# EAGLE schematic ALU (EAGLE 9.6.2)
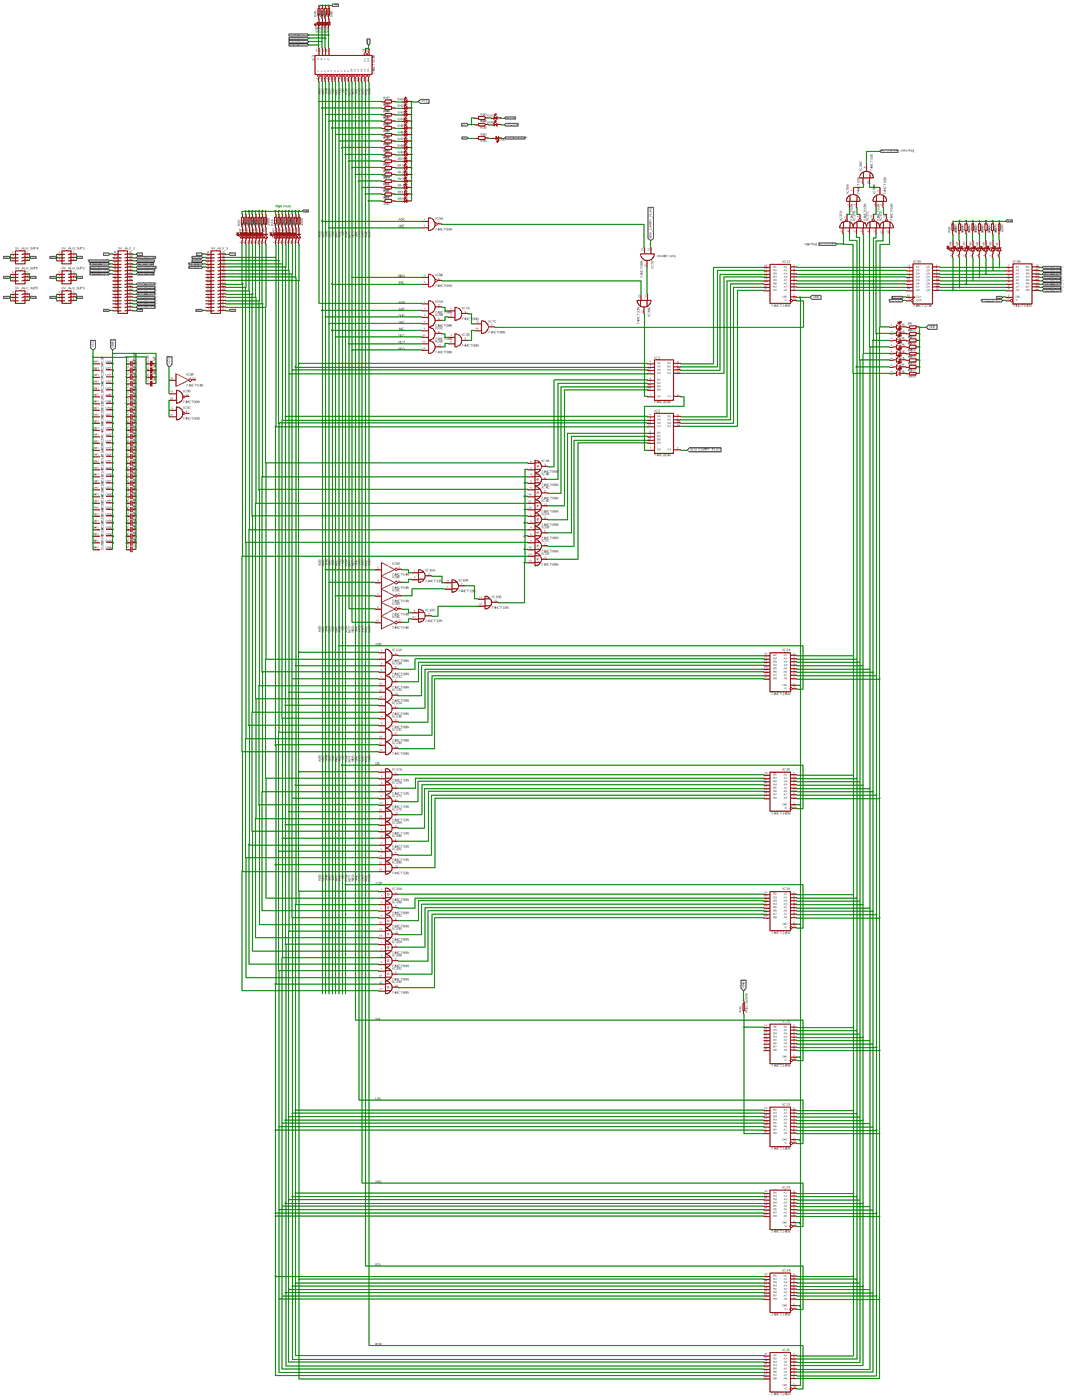
[diagram p0: schematic, sheet 1, overview]
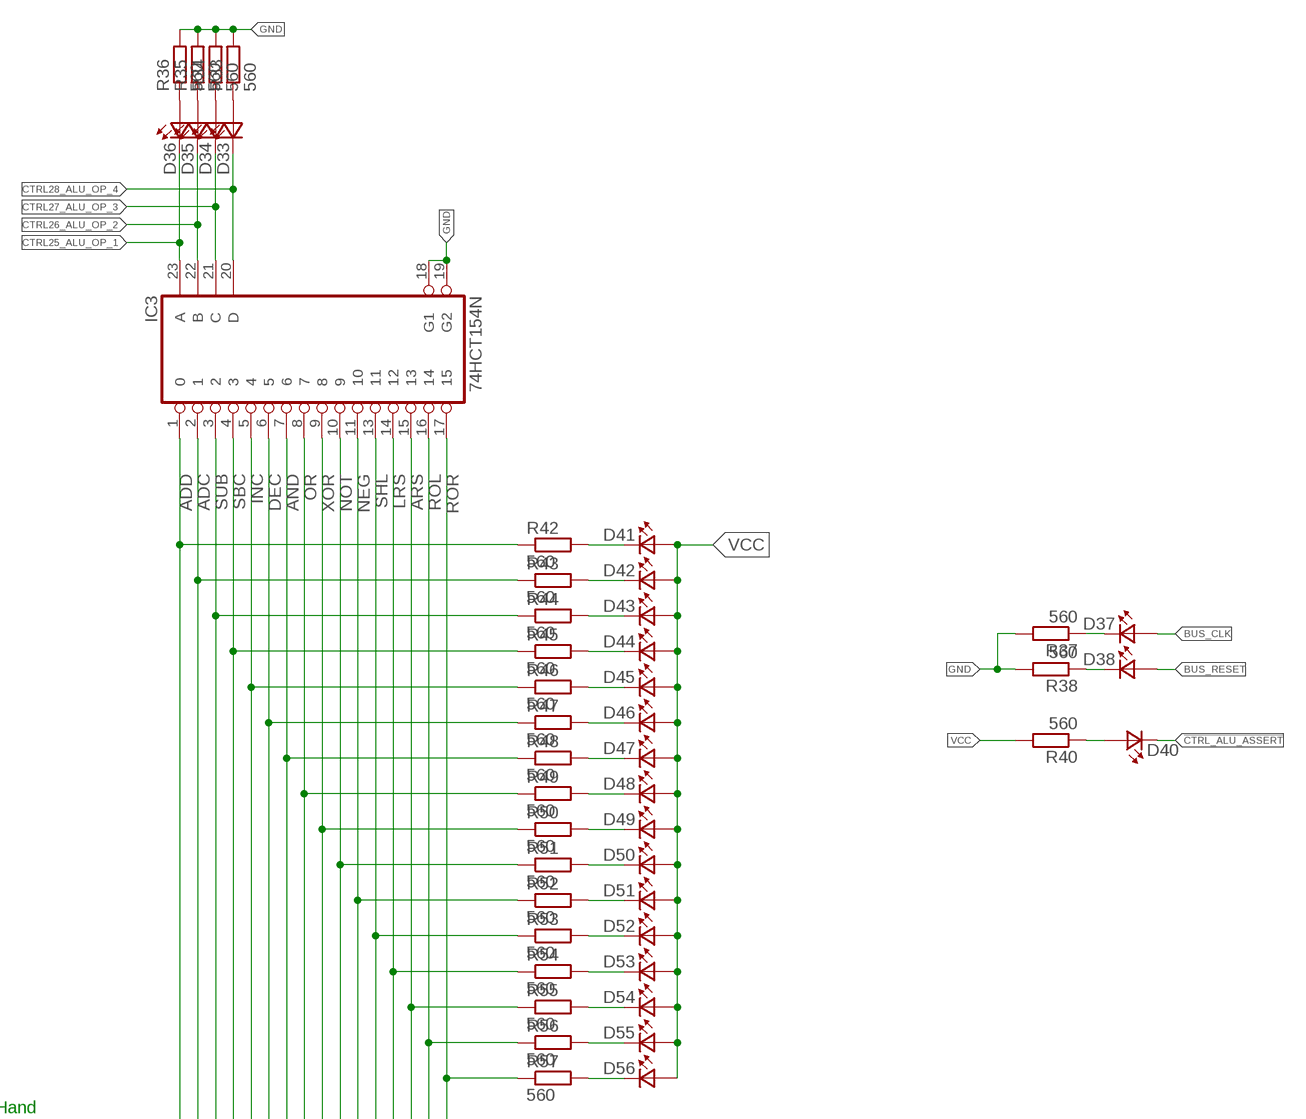
[diagram p1: schematic, sheet 1, part 1 of 8]
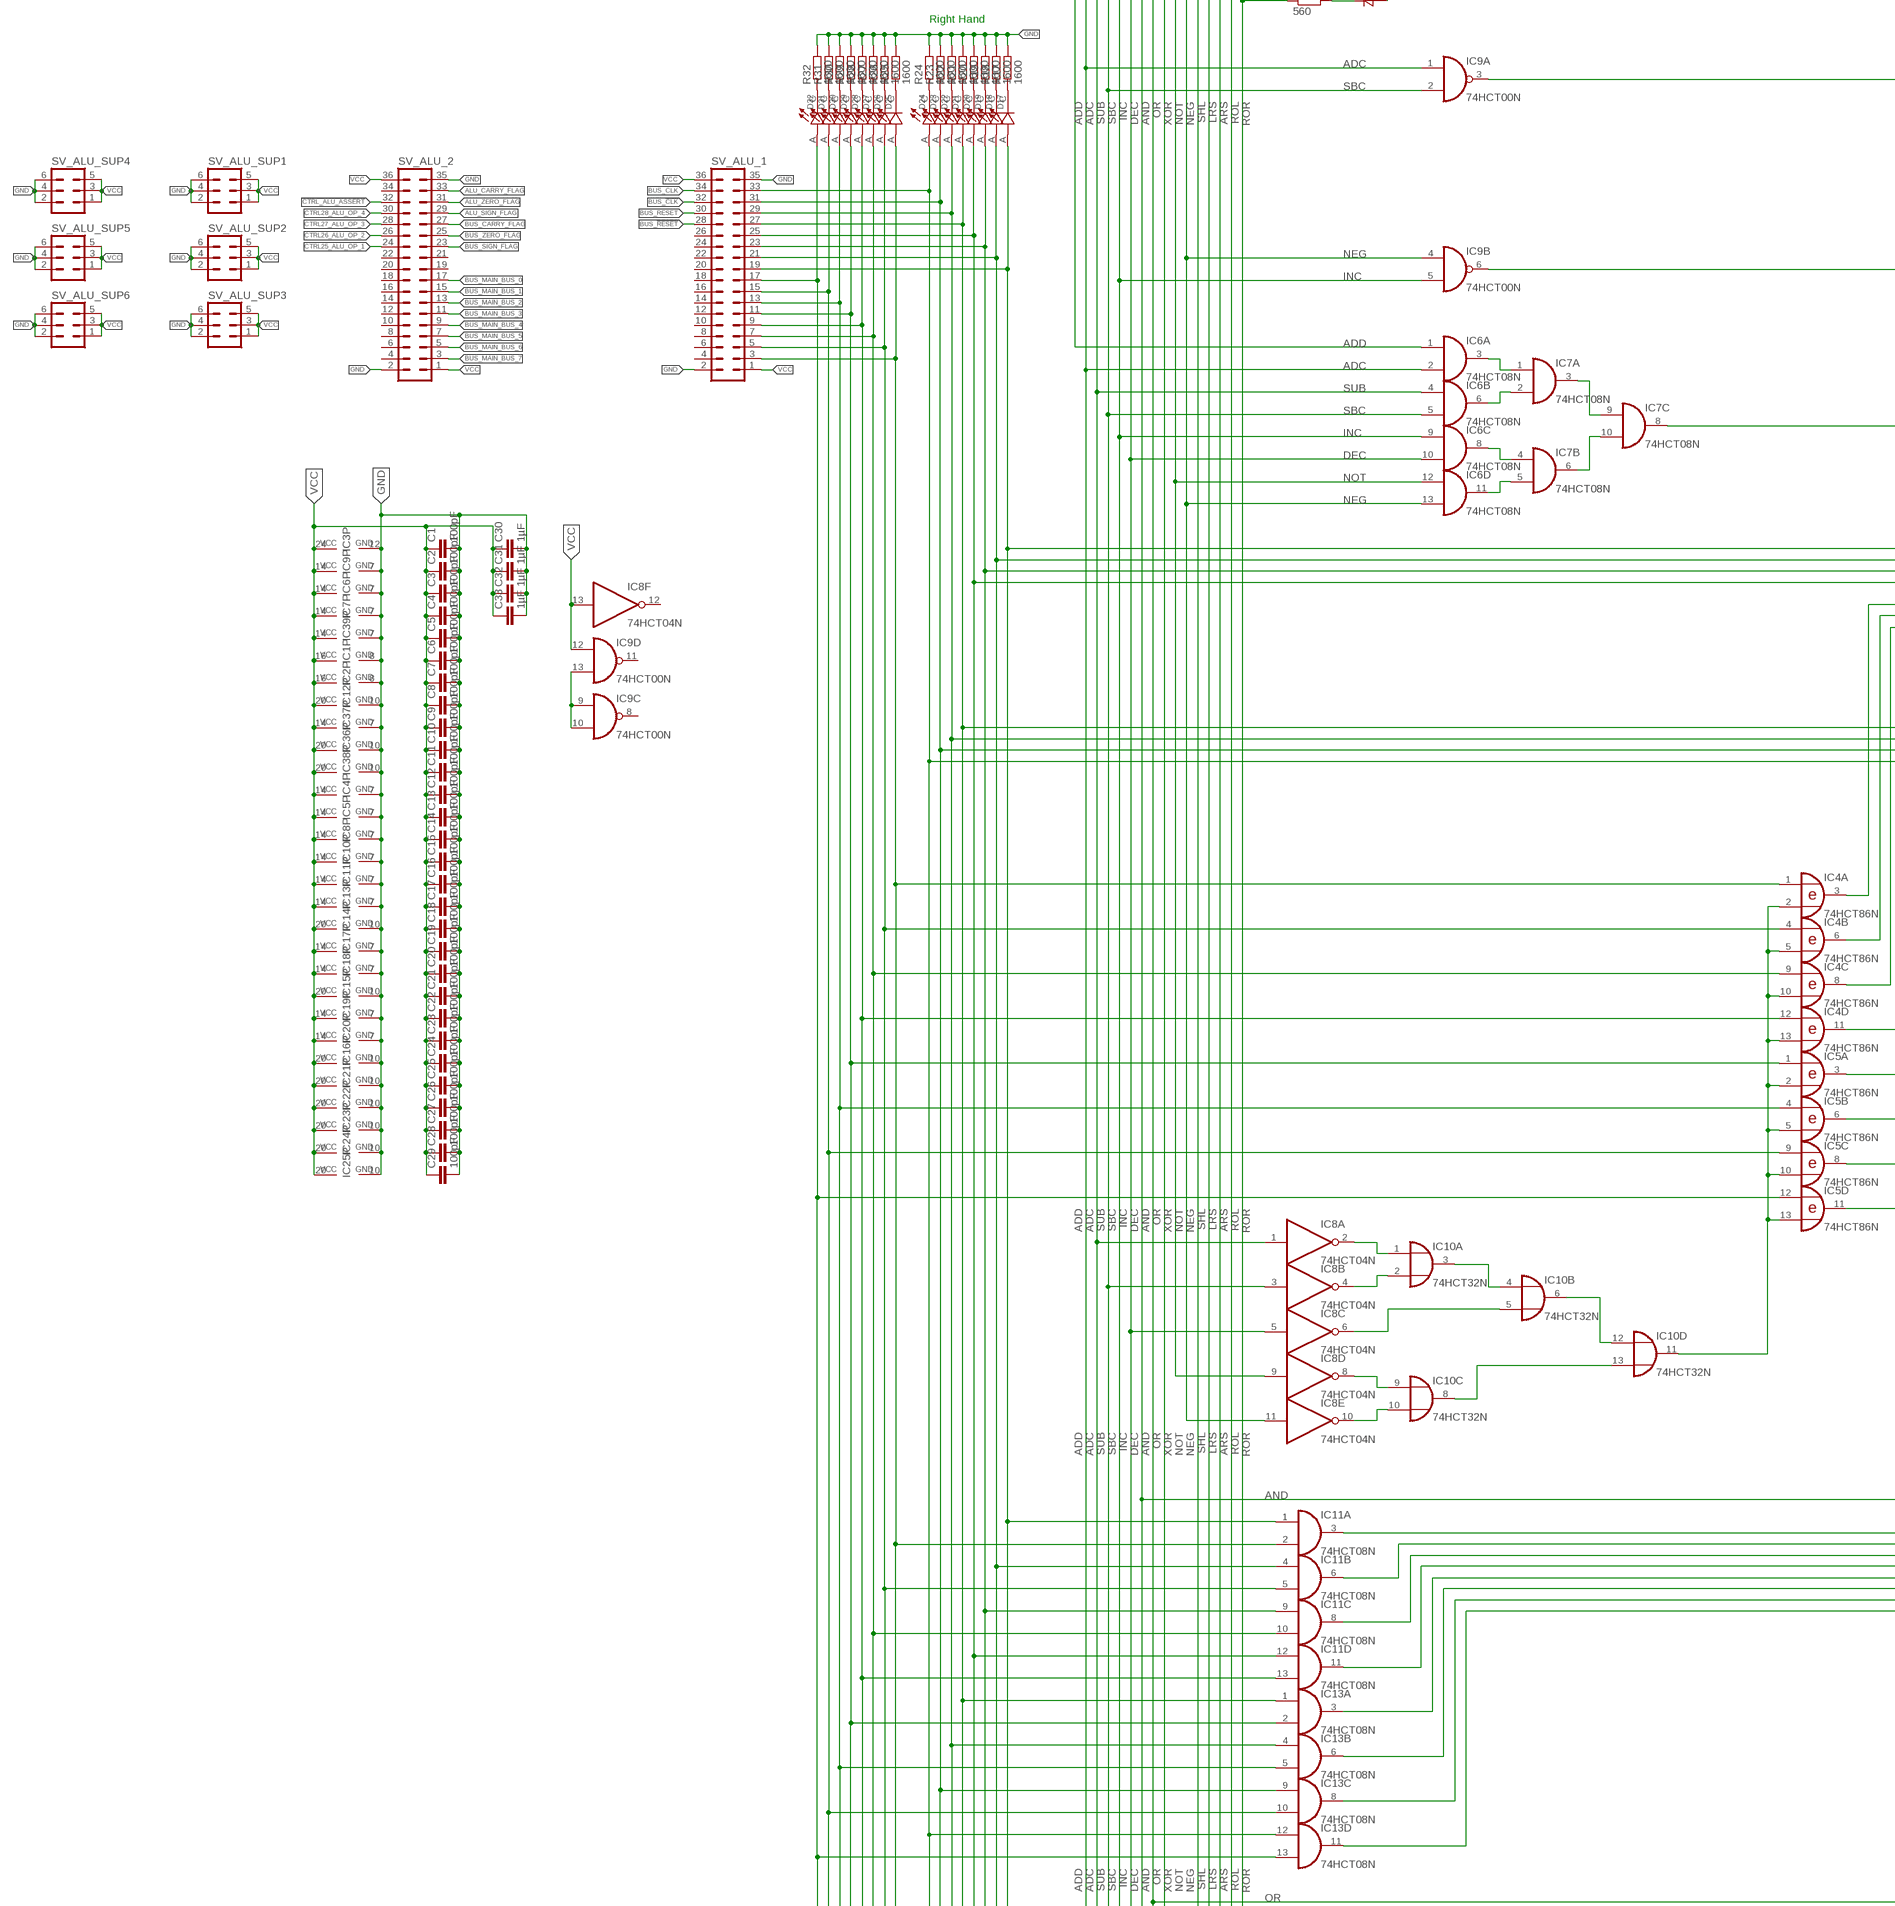
[diagram p2: schematic, sheet 1, part 2 of 8]
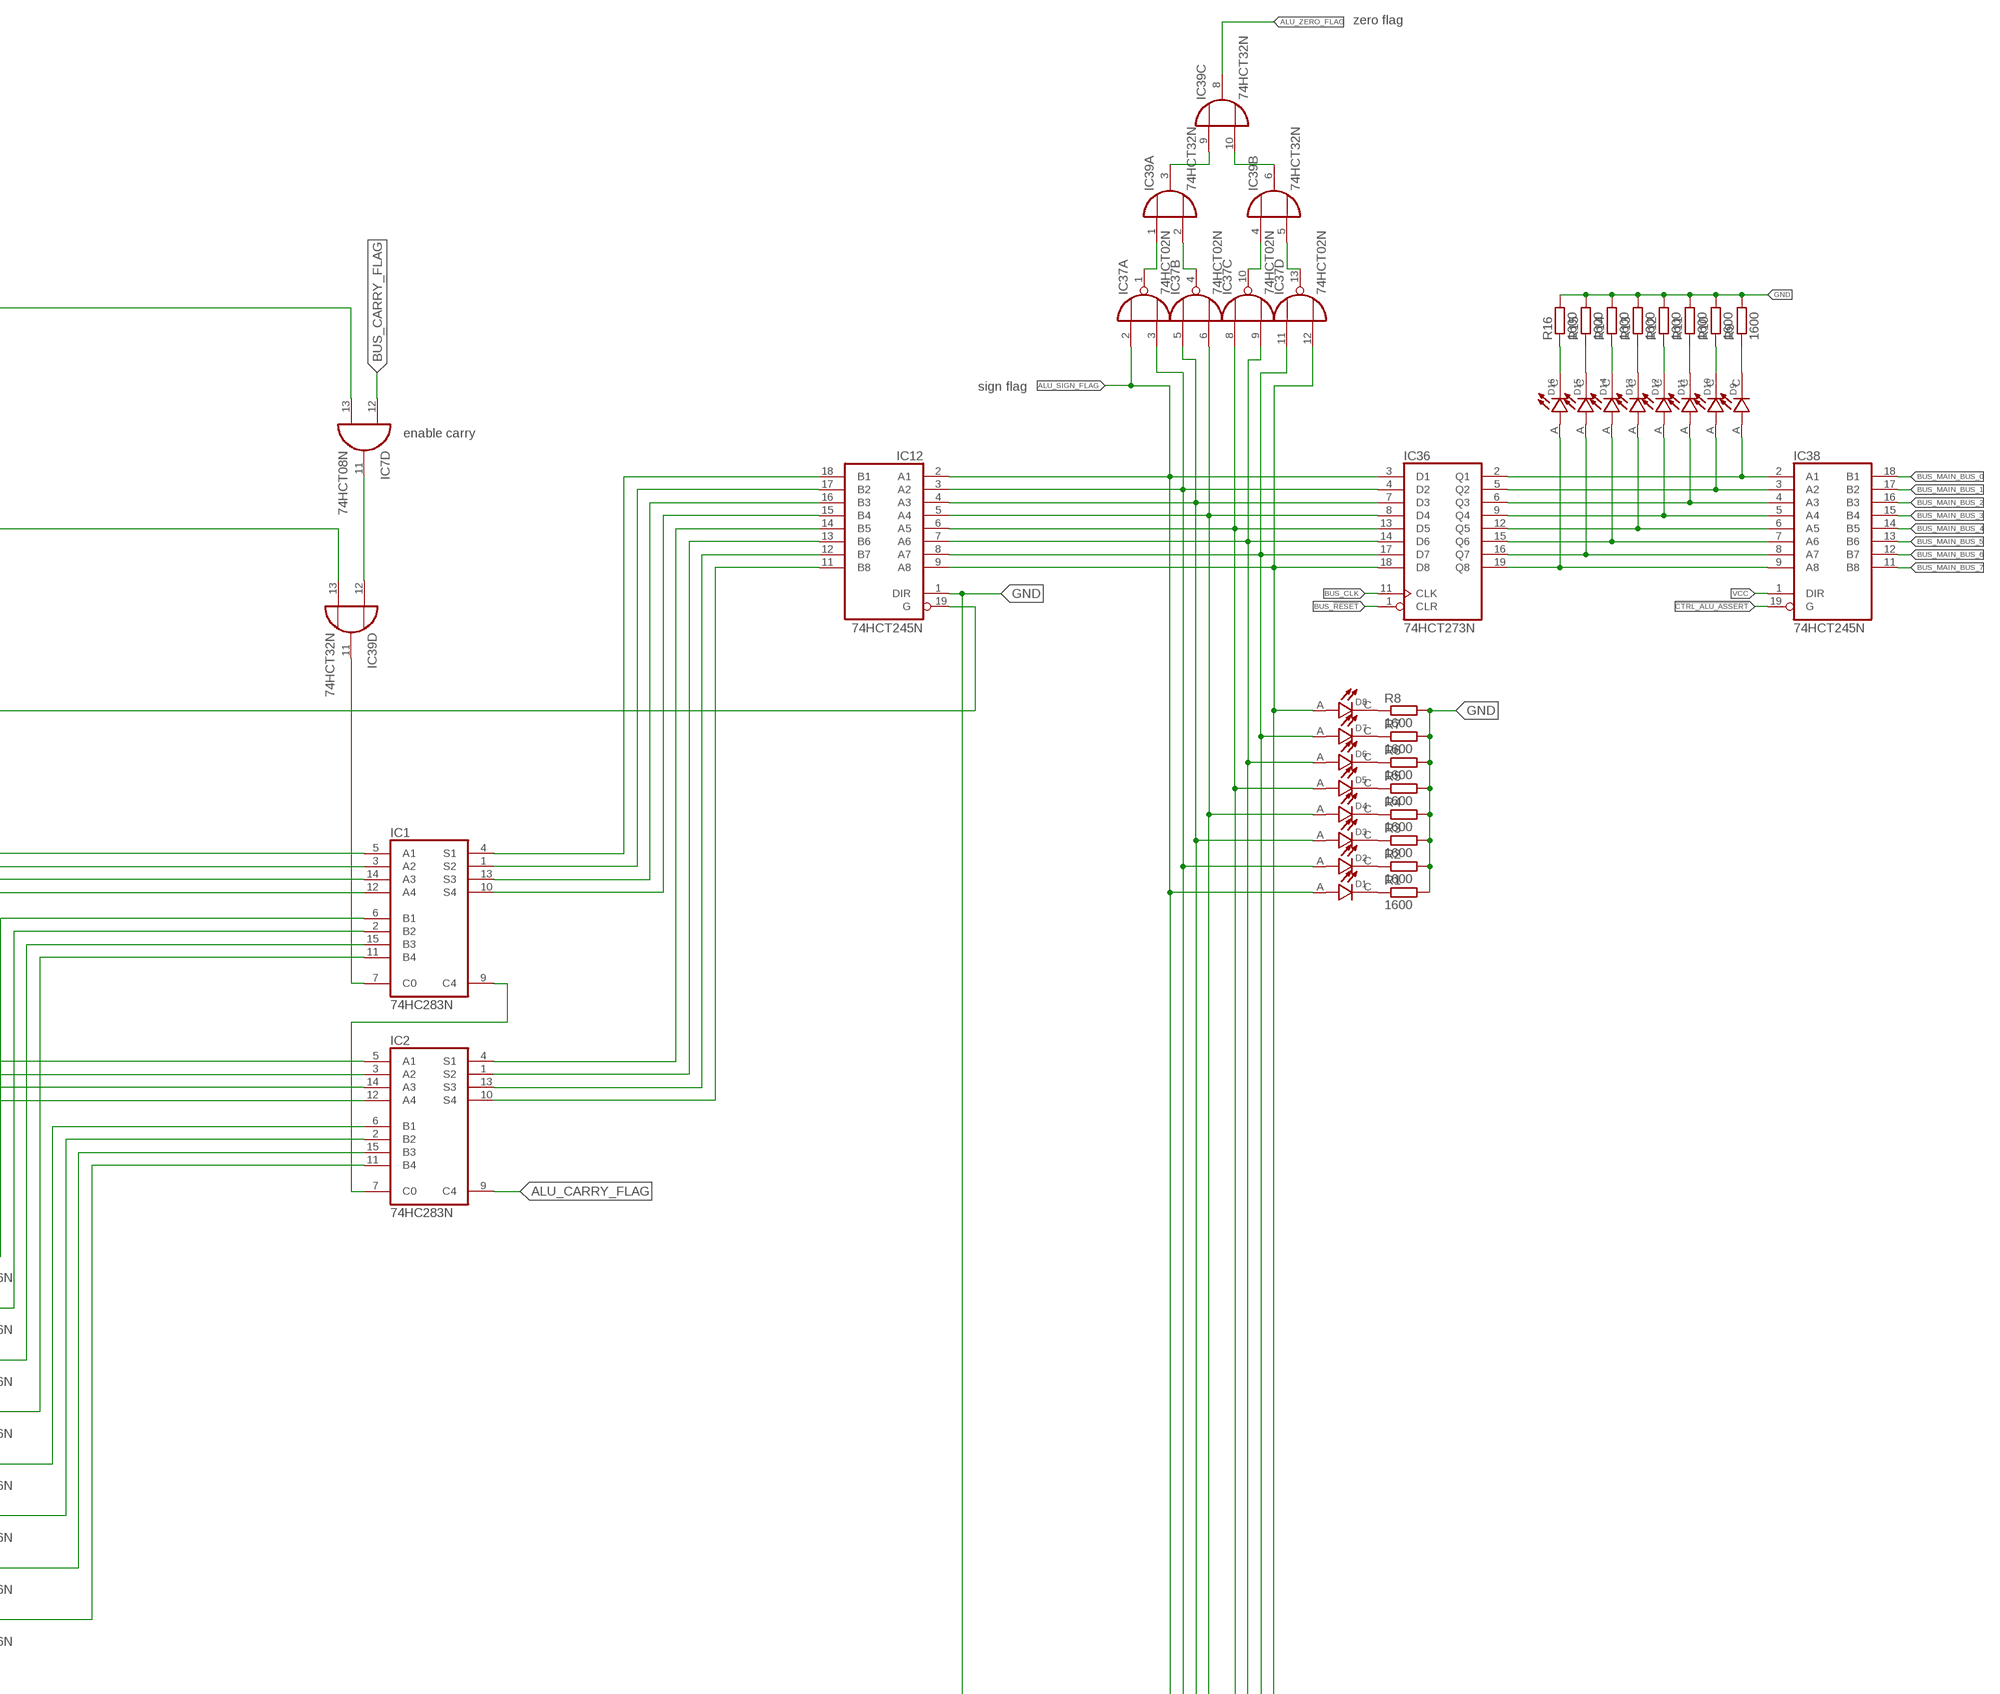
[diagram p3: schematic, sheet 1, part 3 of 8]
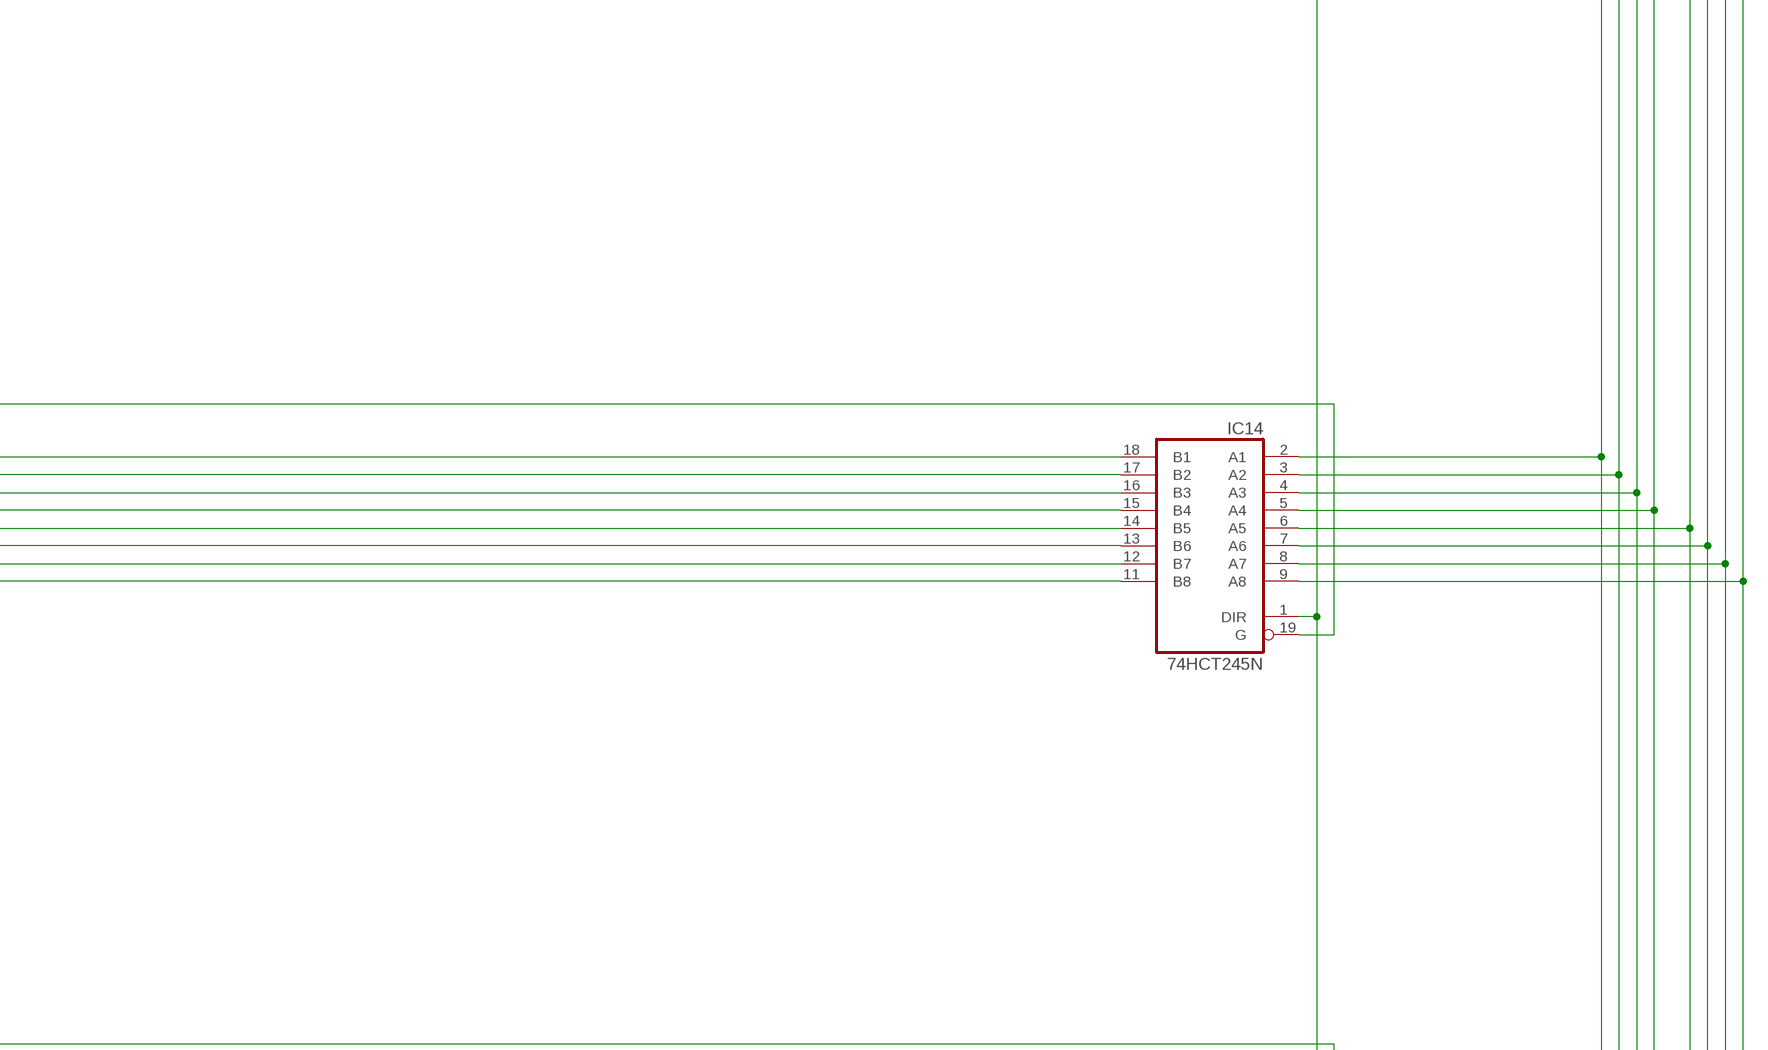
[diagram p4: schematic, sheet 1, part 4 of 8]
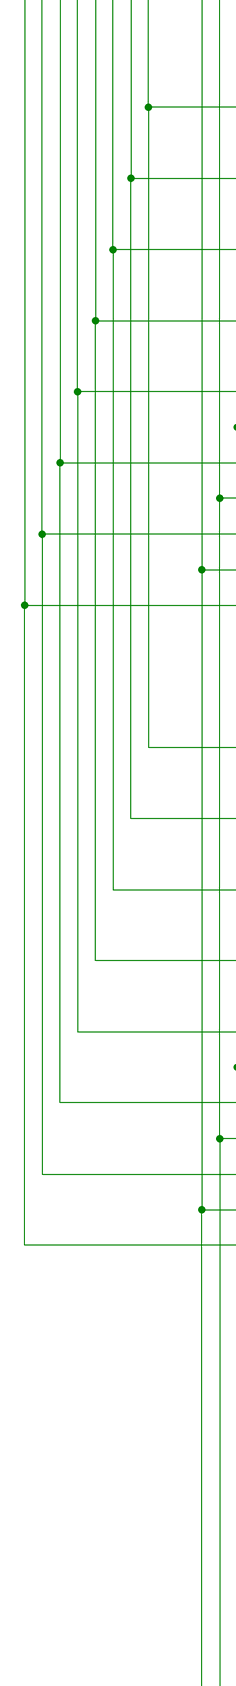
[diagram p5: schematic, sheet 1, part 5 of 8]
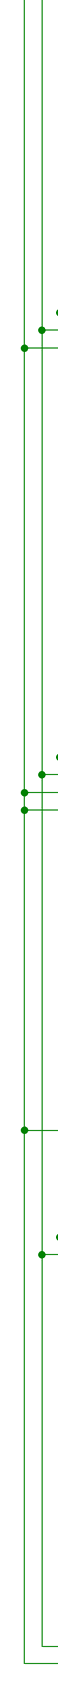
[diagram p6: schematic, sheet 1, part 6 of 8]
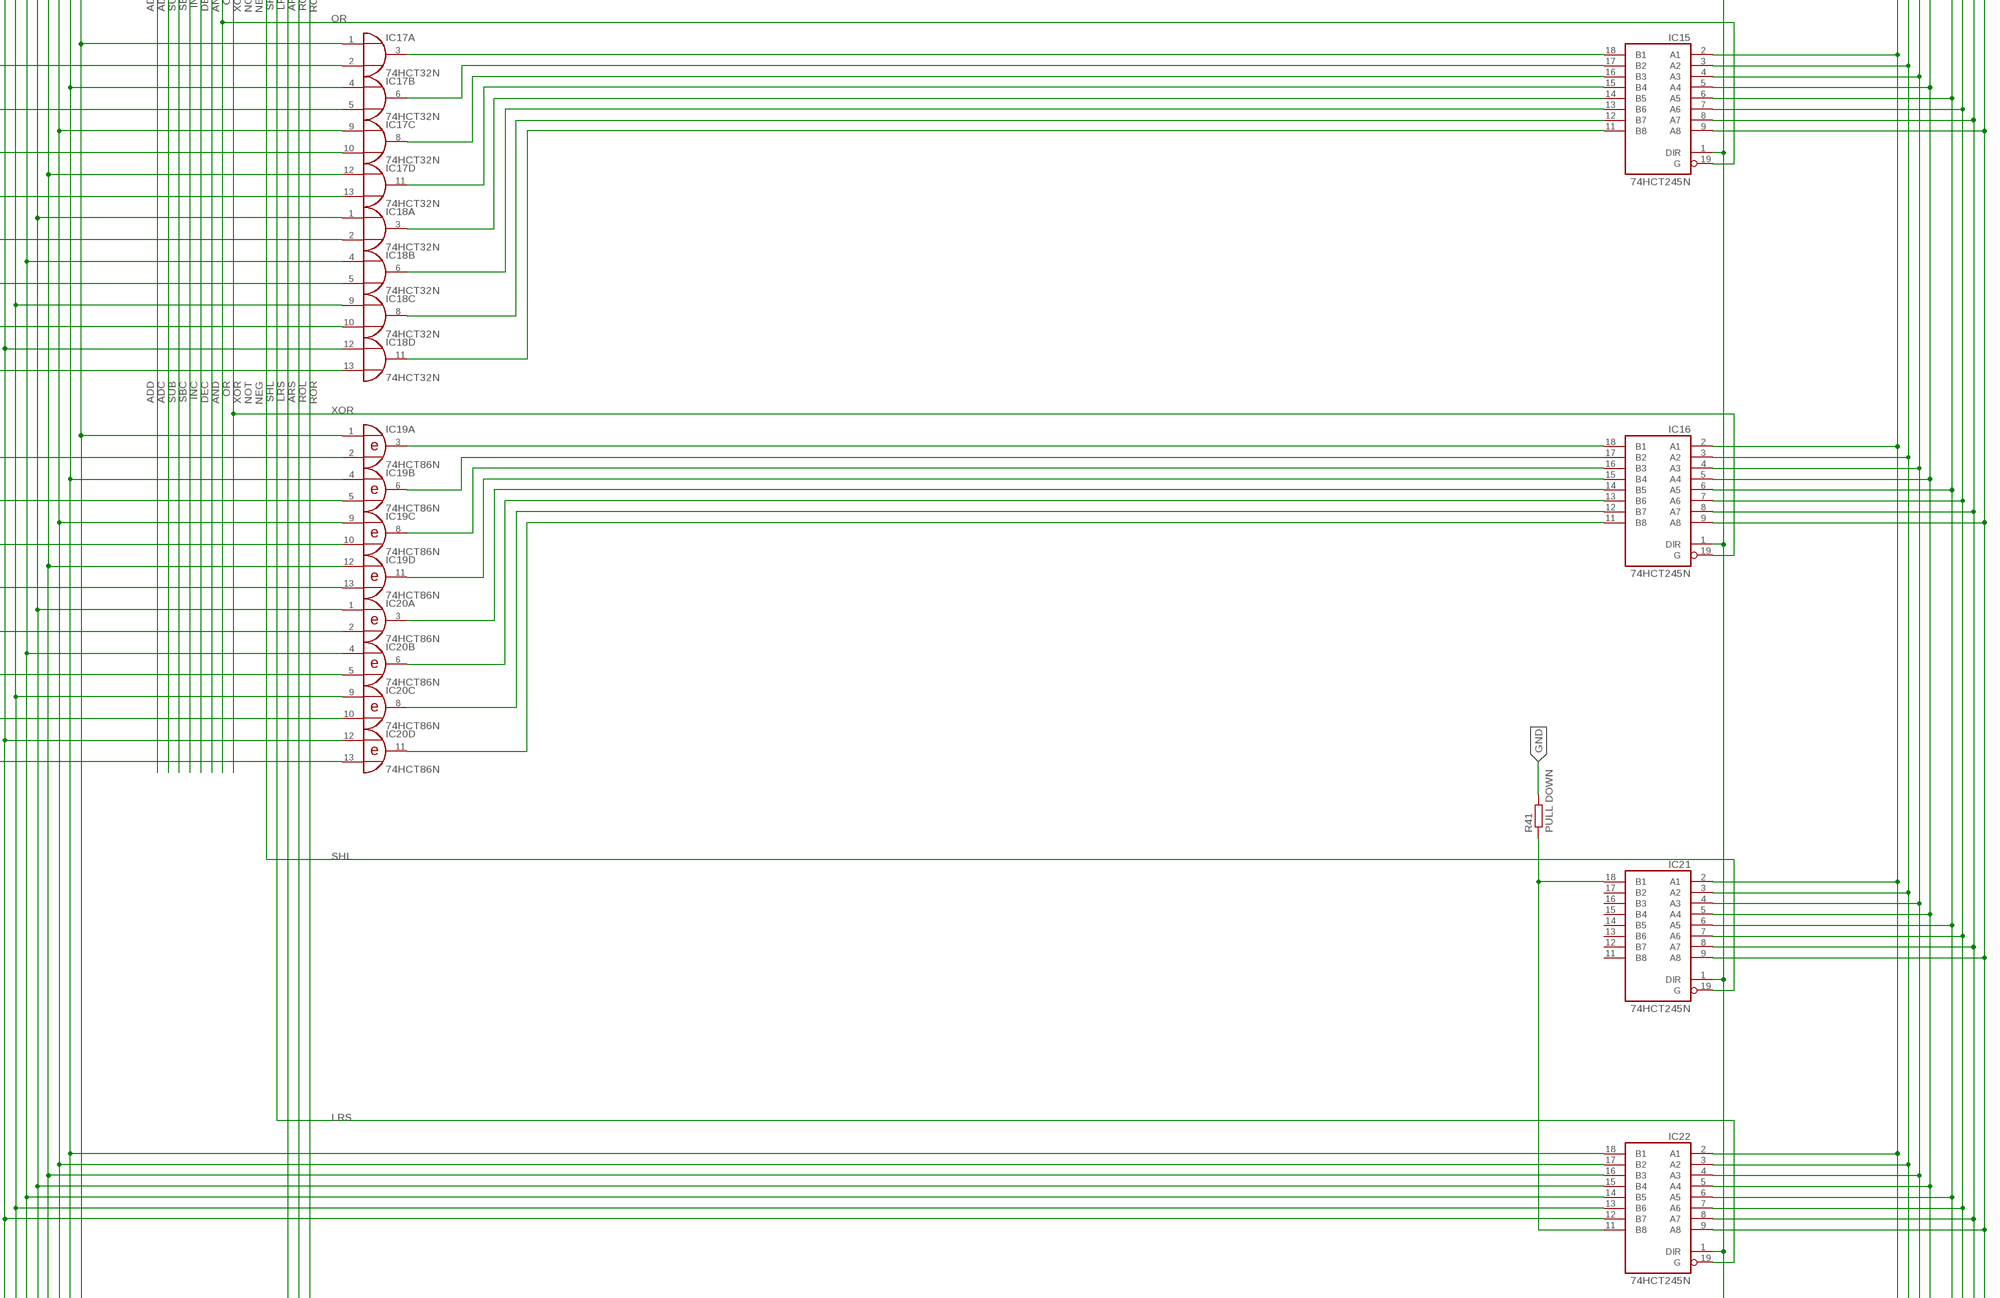
[diagram p7: schematic, sheet 1, part 7 of 8]
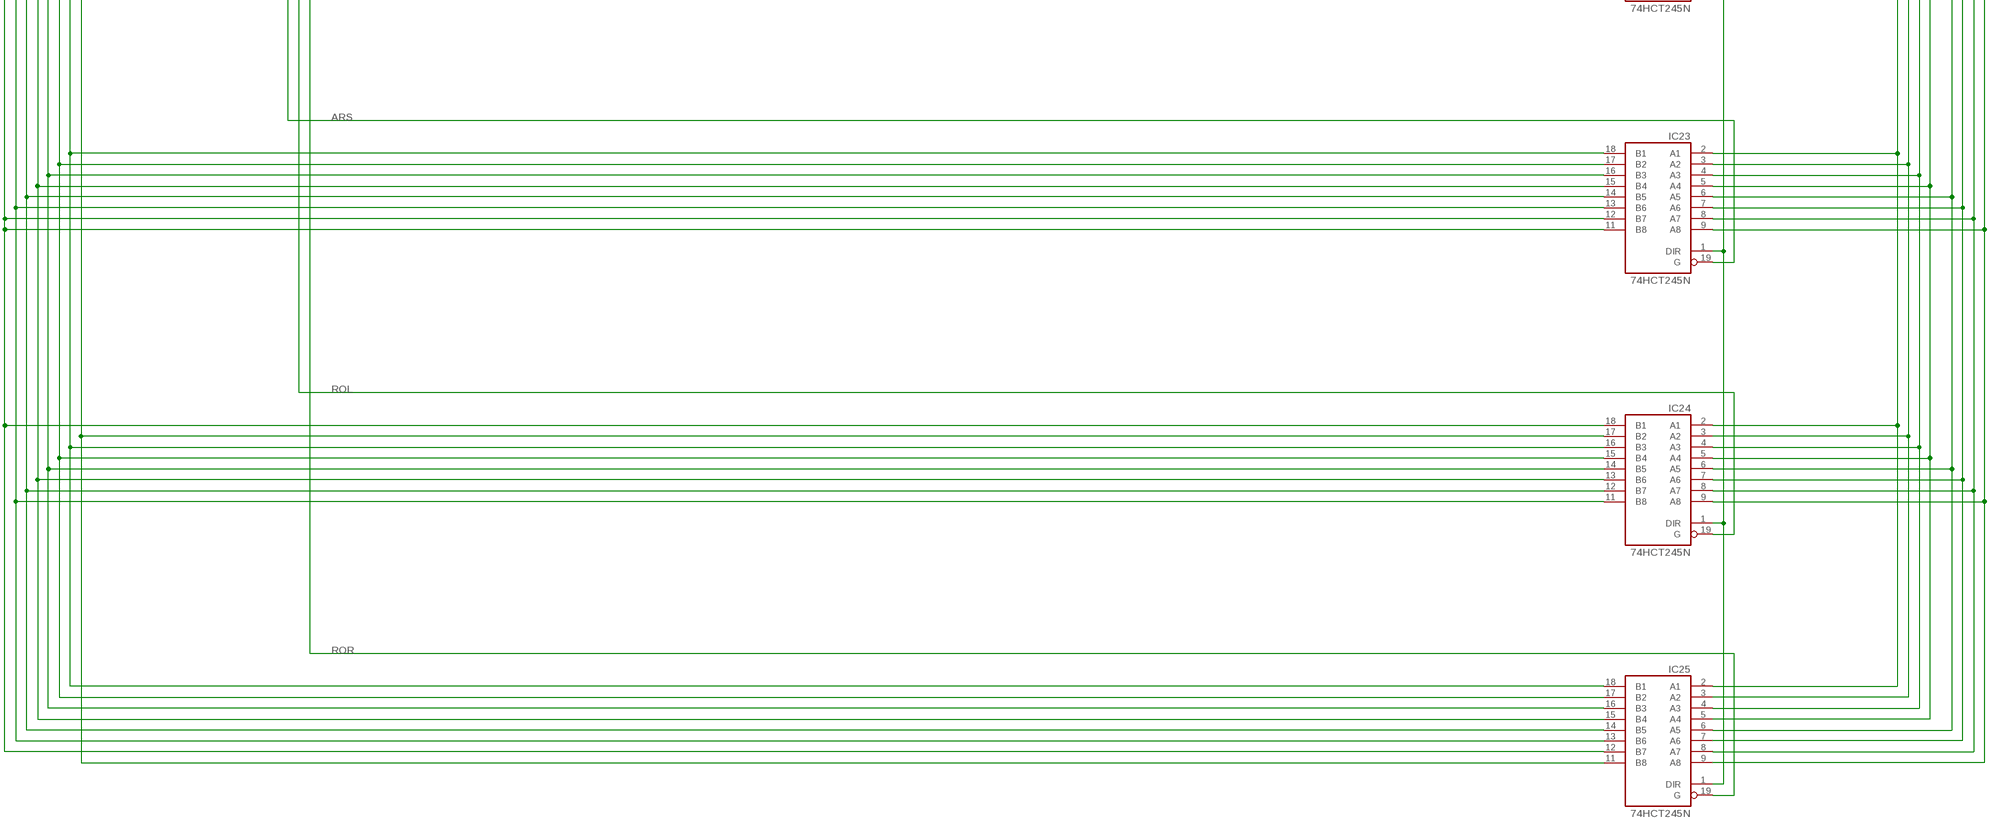
[diagram p8: schematic, sheet 1, part 8 of 8]

## Parts
C1  100pF  C-EUC0805  [C0805]
C2  100pF  C-EUC0805  [C0805]
C3  100pF  C-EUC0805  [C0805]
C4  100pF  C-EUC0805  [C0805]
C5  100pF  C-EUC0805  [C0805]
C6  100pF  C-EUC0805  [C0805]
C7  100pF  C-EUC0805  [C0805]
C8  100pF  C-EUC0805  [C0805]
C9  100pF  C-EUC0805  [C0805]
C10  100pF  C-EUC0805  [C0805]
C11  100pF  C-EUC0805  [C0805]
C12  100pF  C-EUC0805  [C0805]
C13  100pF  C-EUC0805  [C0805]
C14  100pF  C-EUC0805  [C0805]
C15  100pF  C-EUC0805  [C0805]
C16  100pF  C-EUC0805  [C0805]
C17  100pF  C-EUC0805  [C0805]
C18  100pF  C-EUC0805  [C0805]
C19  100pF  C-EUC0805  [C0805]
C20  100pF  C-EUC0805  [C0805]
C21  100pF  C-EUC0805  [C0805]
C22  100pF  C-EUC0805  [C0805]
C23  100pF  C-EUC0805  [C0805]
C24  100pF  C-EUC0805  [C0805]
C25  100pF  C-EUC0805  [C0805]
C26  100pF  C-EUC0805  [C0805]
C27  100pF  C-EUC0805  [C0805]
C28  100pF  C-EUC0805  [C0805]
C29  100pF  C-EUC0805  [C0805]
C30  1µF  C-EUC0805  [C0805]
C31  1µF  C-EUC0805  [C0805]
C32  1µF  C-EUC0805  [C0805]
C33  1µF  C-EUC0805  [C0805]
D1  LTST-C193KRKT-5A  [LEDC1608X45N]
D2  LTST-C193KRKT-5A  [LEDC1608X45N]
D3  LTST-C193KRKT-5A  [LEDC1608X45N]
D4  LTST-C193KRKT-5A  [LEDC1608X45N]
D5  LTST-C193KRKT-5A  [LEDC1608X45N]
D6  LTST-C193KRKT-5A  [LEDC1608X45N]
D7  LTST-C193KRKT-5A  [LEDC1608X45N]
D8  LTST-C193KRKT-5A  [LEDC1608X45N]
D9  LTST-C193KRKT-5A  [LEDC1608X45N]
D10  LTST-C193KRKT-5A  [LEDC1608X45N]
D11  LTST-C193KRKT-5A  [LEDC1608X45N]
D12  LTST-C193KRKT-5A  [LEDC1608X45N]
D13  LTST-C193KRKT-5A  [LEDC1608X45N]
D14  LTST-C193KRKT-5A  [LEDC1608X45N]
D15  LTST-C193KRKT-5A  [LEDC1608X45N]
D16  LTST-C193KRKT-5A  [LEDC1608X45N]
D17  LTST-C193KRKT-5A  [LEDC1608X45N]
D18  LTST-C193KRKT-5A  [LEDC1608X45N]
D19  LTST-C193KRKT-5A  [LEDC1608X45N]
D20  LTST-C193KRKT-5A  [LEDC1608X45N]
D21  LTST-C193KRKT-5A  [LEDC1608X45N]
D22  LTST-C193KRKT-5A  [LEDC1608X45N]
D23  LTST-C193KRKT-5A  [LEDC1608X45N]
D24  LTST-C193KRKT-5A  [LEDC1608X45N]
D25  LTST-C193KRKT-5A  [LEDC1608X45N]
D26  LTST-C193KRKT-5A  [LEDC1608X45N]
D27  LTST-C193KRKT-5A  [LEDC1608X45N]
D28  LTST-C193KRKT-5A  [LEDC1608X45N]
D29  LTST-C193KRKT-5A  [LEDC1608X45N]
D30  LTST-C193KRKT-5A  [LEDC1608X45N]
D31  LTST-C193KRKT-5A  [LEDC1608X45N]
D32  LTST-C193KRKT-5A  [LEDC1608X45N]
D33  LTST-C193TBKT-5A  [0603]
D34  LTST-C193TBKT-5A  [0603]
D35  LTST-C193TBKT-5A  [0603]
D36  LTST-C193TBKT-5A  [0603]
D37  LTST-C193TBKT-5A  [0603]
D38  LTST-C193TBKT-5A  [0603]
D40  LTST-C193TBKT-5A  [0603]
D41  LTST-C193TBKT-5A  [0603]
D42  LTST-C193TBKT-5A  [0603]
D43  LTST-C193TBKT-5A  [0603]
D44  LTST-C193TBKT-5A  [0603]
D45  LTST-C193TBKT-5A  [0603]
D46  LTST-C193TBKT-5A  [0603]
D47  LTST-C193TBKT-5A  [0603]
D48  LTST-C193TBKT-5A  [0603]
D49  LTST-C193TBKT-5A  [0603]
D50  LTST-C193TBKT-5A  [0603]
D51  LTST-C193TBKT-5A  [0603]
D52  LTST-C193TBKT-5A  [0603]
D53  LTST-C193TBKT-5A  [0603]
D54  LTST-C193TBKT-5A  [0603]
D55  LTST-C193TBKT-5A  [0603]
D56  LTST-C193TBKT-5A  [0603]
IC1  74HC283N  [DIL16]
IC2  74HC283N  [DIL16]
IC3  74HCT154N  [DIL24-6]
IC4  74HCT86N  [DIL14]
IC5  74HCT86N  [DIL14]
IC6  74HCT08N  [DIL14]
IC7  74HCT08N  [DIL14]
IC8  74HCT04N  [DIL14]
IC9  74HCT00N  [DIL14]
IC10  74HCT32N  [DIL14]
IC11  74HCT08N  [DIL14]
IC12  74HCT245N  [DIL20]
IC13  74HCT08N  [DIL14]
IC14  74HCT245N  [DIL20]
IC15  74HCT245N  [DIL20]
IC16  74HCT245N  [DIL20]
IC17  74HCT32N  [DIL14]
IC18  74HCT32N  [DIL14]
IC19  74HCT86N  [DIL14]
IC20  74HCT86N  [DIL14]
IC21  74HCT245N  [DIL20]
IC22  74HCT245N  [DIL20]
IC23  74HCT245N  [DIL20]
IC24  74HCT245N  [DIL20]
IC25  74HCT245N  [DIL20]
IC36  74HCT273N  [DIL20]
IC37  74HCT02N  [DIL14]
IC38  74HCT245N  [DIL20]
IC39  74HCT32N  [DIL14]
R1  1600  R-EU_R0805  [R0805]
R2  1600  R-EU_R0805  [R0805]
R3  1600  R-EU_R0805  [R0805]
R4  1600  R-EU_R0805  [R0805]
R5  1600  R-EU_R0805  [R0805]
R6  1600  R-EU_R0805  [R0805]
R7  1600  R-EU_R0805  [R0805]
R8  1600  R-EU_R0805  [R0805]
R9  1600  R-EU_R0805  [R0805]
R10  1600  R-EU_R0805  [R0805]
R11  1600  R-EU_R0805  [R0805]
R12  1600  R-EU_R0805  [R0805]
R13  1600  R-EU_R0805  [R0805]
R14  1600  R-EU_R0805  [R0805]
R15  1600  R-EU_R0805  [R0805]
R16  1600  R-EU_R0805  [R0805]
R17  1600  R-EU_R0805  [R0805]
R18  1600  R-EU_R0805  [R0805]
R19  1600  R-EU_R0805  [R0805]
R20  1600  R-EU_R0805  [R0805]
R21  1600  R-EU_R0805  [R0805]
R22  1600  R-EU_R0805  [R0805]
R23  1600  R-EU_R0805  [R0805]
R24  1600  R-EU_R0805  [R0805]
R25  1600  R-EU_R0805  [R0805]
R26  1600  R-EU_R0805  [R0805]
R27  1600  R-EU_R0805  [R0805]
R28  1600  R-EU_R0805  [R0805]
R29  1600  R-EU_R0805  [R0805]
R30  1600  R-EU_R0805  [R0805]
R31  1600  R-EU_R0805  [R0805]
R32  1600  R-EU_R0805  [R0805]
R33  560  R-EU_R0805  [R0805]
R34  560  R-EU_R0805  [R0805]
R35  560  R-EU_R0805  [R0805]
R36  560  R-EU_R0805  [R0805]
R37  560  R-EU_R0805  [R0805]
R38  560  R-EU_R0805  [R0805]
R40  560  R-EU_R0805  [R0805]
R41  PULL DOWN  R-EU_R0805  [R0805]
R42  560  R-EU_R0805  [R0805]
R43  560  R-EU_R0805  [R0805]
R44  560  R-EU_R0805  [R0805]
R45  560  R-EU_R0805  [R0805]
R46  560  R-EU_R0805  [R0805]
R47  560  R-EU_R0805  [R0805]
R48  560  R-EU_R0805  [R0805]
R49  560  R-EU_R0805  [R0805]
R50  560  R-EU_R0805  [R0805]
R51  560  R-EU_R0805  [R0805]
R52  560  R-EU_R0805  [R0805]
R53  560  R-EU_R0805  [R0805]
R54  560  R-EU_R0805  [R0805]
R55  560  R-EU_R0805  [R0805]
R56  560  R-EU_R0805  [R0805]
R57  560  R-EU_R0805  [R0805]
SV_ALU_1  MA18-2  [MA18-2]
SV_ALU_2  MA18-2  [MA18-2]
SV_ALU_SUP1  MA03-2  [MA03-2]
SV_ALU_SUP2  MA03-2  [MA03-2]
SV_ALU_SUP3  MA03-2  [MA03-2]
SV_ALU_SUP4  MA03-2  [MA03-2]
SV_ALU_SUP5  MA03-2  [MA03-2]
SV_ALU_SUP6  MA03-2  [MA03-2]

## Nets
!CTRL_ALU_ASSERT: D40.1(K2) IC38.19(G) SV_ALU_2.32
ADC: IC3.2 IC6.2(A:I1) IC9.1(A:I0) R43.1
ADD: IC3.1 IC6.1(A:I0) R42.1
ALU_CARRY_FLAG: IC2.9(C4) SV_ALU_2.33
ALU_SIGN_FLAG: D1.A IC12.2(A1) IC14.2(A1) IC15.2(A1) IC16.2(A1) IC21.2(A1) IC22.2(A1) IC23.2(A1) IC24.2(A1) IC25.2(A1) IC36.3(D1) IC37.2(A:I0) SV_ALU_2.29
ALU_ZERO_FLAG: IC39.8(C:O) SV_ALU_2.31
AND: IC3.7 IC14.19(G) R48.1
ARS: IC3.15 IC23.19(G) R55.1
BUS_!CLK: SV_ALU_1.32
BUS_!RESET: IC36.1(CLR) SV_ALU_1.28
BUS_CARRY_FLAG: IC7.12(D:I0) SV_ALU_2.27
BUS_CLK: D37.2(A2) IC36.11(CLK) SV_ALU_1.34
BUS_MAIN_BUS_0: IC38.18(B1) SV_ALU_2.17
BUS_MAIN_BUS_1: IC38.17(B2) SV_ALU_2.15
BUS_MAIN_BUS_2: IC38.16(B3) SV_ALU_2.13
BUS_MAIN_BUS_3: IC38.15(B4) SV_ALU_2.11
BUS_MAIN_BUS_4: IC38.14(B5) SV_ALU_2.9
BUS_MAIN_BUS_5: IC38.13(B6) SV_ALU_2.7
BUS_MAIN_BUS_6: IC38.12(B7) SV_ALU_2.5
BUS_MAIN_BUS_7: IC38.11(B8) SV_ALU_2.3
BUS_RESET: D38.2(A2) SV_ALU_1.30
BUS_SIGN_FLAG: SV_ALU_2.23
BUS_ZERO_FLAG: SV_ALU_2.25
CTRL25_ALU_OP_1: D36.1(K2) IC3.23(A) SV_ALU_2.24
CTRL26_ALU_OP_2: D35.1(K2) IC3.22(B) SV_ALU_2.26
CTRL27_ALU_OP_3: D34.1(K2) IC3.21(C) SV_ALU_2.28
CTRL28_ALU_OP_4: D33.1(K2) IC3.20(D) SV_ALU_2.30
DEC: IC3.6 IC6.10(C:I1) IC8.5(C:I) R47.1
GND: C1.2 C2.2 C3.2 C4.2 C5.2 C6.2 C7.2 C8.2 C9.2 C10.2 C11.2 C12.2 C13.2 C14.2 C15.2 C16.2 C17.2 C18.2 C19.2 C20.2 C21.2 C22.2 C23.2 C24.2 C25.2 C26.2 C27.2 C28.2 C29.2 C30.2 C31.2 C32.2 C33.2 IC1.8(GND) IC2.8(GND) IC3.12(GND) IC3.18(G1) IC3.19(G2) IC4.7(P:GND) IC5.7(P:GND) IC6.7(P:GND) IC7.7(P:GND) IC8.7(P:GND) IC9.7(P:GND) IC10.7(P:GND) IC11.7(P:GND) IC12.1(DIR) IC12.10(GND) IC13.7(P:GND) IC14.1(DIR) IC14.10(GND) IC15.1(DIR) IC15.10(GND) IC16.1(DIR) IC16.10(GND) IC17.7(P:GND) IC18.7(P:GND) IC19.7(P:GND) IC20.7(P:GND) IC21.1(DIR) IC21.10(GND) IC22.1(DIR) IC22.10(GND) IC23.1(DIR) IC23.10(GND) IC24.1(DIR) IC24.10(GND) IC25.1(DIR) IC25.10(GND) IC36.10(GND) IC37.7(P:GND) IC38.10(GND) IC39.7(P:GND) R1.2 R2.2 R3.2 R4.2 R5.2 R6.2 R7.2 R8.2 R9.2 R10.2 R11.2 R12.2 R13.2 R14.2 R15.2 R16.2 R17.2 R18.2 R19.2 R20.2 R21.2 R22.2 R23.2 R24.2 R25.2 R26.2 R27.2 R28.2 R29.2 R30.2 R31.2 R32.2 R33.2 R34.2 R35.2 R36.2 R37.2 R38.2 R41.2 SV_ALU_1.2 SV_ALU_1.35 SV_ALU_2.2 SV_ALU_2.35 SV_ALU_SUP1.2 SV_ALU_SUP1.4 SV_ALU_SUP1.6 SV_ALU_SUP2.2 SV_ALU_SUP2.4 SV_ALU_SUP2.6 SV_ALU_SUP3.2 SV_ALU_SUP3.4 SV_ALU_SUP3.6 SV_ALU_SUP4.2 SV_ALU_SUP4.4 SV_ALU_SUP4.6 SV_ALU_SUP5.2 SV_ALU_SUP5.4 SV_ALU_SUP5.6 SV_ALU_SUP6.2 SV_ALU_SUP6.4 SV_ALU_SUP6.6
INC: IC3.5 IC6.9(C:I0) IC9.5(B:I1) R46.1
LRS: IC3.14 IC22.19(G) R54.1
N$1: IC4.2(A:I1) IC4.5(B:I1) IC4.10(C:I1) IC4.13(D:I1) IC5.2(A:I1) IC5.5(B:I1) IC5.10(C:I1) IC5.13(D:I1) IC10.11(D:O)
N$2: IC1.6(B1) IC4.3(A:O)
N$3: D33.2(A2) R33.1
N$4: IC1.2(B2) IC4.6(B:O)
N$5: D27.A IC4.9(C:I0) IC11.10(C:I1) IC17.10(C:I1) IC19.10(C:I1) SV_ALU_1.7
N$6: IC1.15(B3) IC4.8(C:O)
N$7: IC1.11(B4) IC4.11(D:O)
N$8: IC2.6(B1) IC5.3(A:O)
N$9: IC2.2(B2) IC5.6(B:O)
N$10: IC2.15(B3) IC5.8(C:O)
N$11: IC2.11(B4) IC5.11(D:O)
N$12: IC1.9(C4) IC2.7(C0)
N$13: IC1.7(C0) IC39.11(D:O)
N$14: IC1.4(S1) IC12.18(B1)
N$15: IC1.1(S2) IC12.17(B2)
N$16: D16.C R16.1
N$17: IC1.13(S3) IC12.16(B3)
N$18: IC1.10(S4) IC12.15(B4)
N$19: IC2.4(S1) IC12.14(B5)
N$20: IC37.1(A:O) IC39.1(A:I0)
N$21: IC37.4(B:O) IC39.2(A:I1)
N$22: IC37.10(C:O) IC39.4(B:I0)
N$23: IC37.13(D:O) IC39.5(B:I1)
N$24: D15.C R15.1
N$25: IC39.6(B:O) IC39.10(C:I1)
N$26: IC39.3(A:O) IC39.9(C:I0)
N$27: D34.2(A2) R34.1
N$28: D35.2(A2) R35.1
N$29: D36.2(A2) R36.1
N$30: D40.2(A2) R40.1
N$32: IC2.1(S2) IC12.13(B6)
N$33: IC2.13(S3) IC12.12(B7)
N$34: IC2.10(S4) IC12.11(B8)
N$35: IC6.3(A:O) IC7.1(A:I0)
N$36: IC6.6(B:O) IC7.2(A:I1)
N$37: IC6.8(C:O) IC7.4(B:I0)
N$38: IC6.11(D:O) IC7.5(B:I1)
N$39: IC7.3(A:O) IC7.9(C:I0)
N$40: IC7.6(B:O) IC7.10(C:I1)
N$41: IC7.8(C:O) IC12.19(G)
N$42: IC7.11(D:O) IC39.12(D:I0)
N$43: IC9.6(B:O) IC39.13(D:I1)
N$44: IC7.13(D:I1) IC9.3(A:O)
N$45: IC8.2(A:O) IC10.1(A:I0)
N$46: IC8.4(B:O) IC10.2(A:I1)
N$47: IC10.3(A:O) IC10.4(B:I0)
N$48: IC8.6(C:O) IC10.5(B:I1)
N$49: IC8.8(D:O) IC10.9(C:I0)
N$50: IC8.10(E:O) IC10.10(C:I1)
N$51: D1.C R1.1
N$52: IC10.8(C:O) IC10.13(D:I1)
N$53: IC10.6(B:O) IC10.12(D:I0)
N$54: D41.1(K2) R42.2
N$55: IC11.6(B:O) IC14.17(B2)
N$56: IC11.8(C:O) IC14.16(B3)
N$57: IC11.11(D:O) IC14.15(B4)
N$58: IC13.3(A:O) IC14.14(B5)
N$59: IC13.6(B:O) IC14.13(B6)
N$60: IC13.8(C:O) IC14.12(B7)
N$61: IC13.11(D:O) IC14.11(B8)
N$62: IC16.18(B1) IC19.3(A:O)
N$63: D14.C R14.1
N$64: D21.A IC2.5(A1) IC13.1(A:I0) IC18.1(A:I0) IC20.1(A:I0) IC22.15(B4) IC23.15(B4) IC24.13(B6) IC25.15(B4) SV_ALU_1.27
N$65: D22.A IC2.3(A2) IC13.4(B:I0) IC18.4(B:I0) IC20.4(B:I0) IC22.14(B5) IC23.14(B5) IC24.12(B7) IC25.14(B5) SV_ALU_1.29
N$66: D23.A IC2.14(A3) IC13.9(C:I0) IC18.9(C:I0) IC20.9(C:I0) IC22.13(B6) IC23.13(B6) IC24.11(B8) IC25.13(B6) SV_ALU_1.31
N$67: D24.A IC2.12(A4) IC13.12(D:I0) IC18.12(D:I0) IC20.12(D:I0) IC22.12(B7) IC23.11(B8) IC23.12(B7) IC24.18(B1) IC25.12(B7) SV_ALU_1.33
N$68: D2.C R2.1
N$69: D32.A IC5.12(D:I0) IC13.13(D:I1) IC18.13(D:I1) IC20.13(D:I1) SV_ALU_1.17
N$70: IC15.17(B2) IC17.6(B:O)
N$71: D13.C R13.1
N$72: D12.C R12.1
N$73: IC15.16(B3) IC17.8(C:O)
N$74: IC15.15(B4) IC17.11(D:O)
N$75: IC15.14(B5) IC18.3(A:O)
N$76: IC15.13(B6) IC18.6(B:O)
N$77: D38.1(K2) R38.1
N$78: D37.1(K2) R37.1
N$79: D17.A IC1.5(A1) IC11.1(A:I0) IC17.1(A:I0) IC19.1(A:I0) IC24.17(B2) IC25.11(B8) SV_ALU_1.19
N$80: D18.A IC1.3(A2) IC11.4(B:I0) IC17.4(B:I0) IC19.4(B:I0) IC22.18(B1) IC23.18(B1) IC24.16(B3) IC25.18(B1) SV_ALU_1.21
N$81: D19.A IC1.14(A3) IC11.9(C:I0) IC17.9(C:I0) IC19.9(C:I0) IC22.17(B2) IC23.17(B2) IC24.15(B4) IC25.17(B2) SV_ALU_1.23
N$82: D20.A IC1.12(A4) IC11.12(D:I0) IC17.12(D:I0) IC19.12(D:I0) IC22.16(B3) IC23.16(B3) IC24.14(B5) IC25.16(B3) SV_ALU_1.25
N$83: IC15.12(B7) IC18.8(C:O)
N$84: IC15.11(B8) IC18.11(D:O)
N$85: IC15.18(B1) IC17.3(A:O)
N$86: IC16.17(B2) IC19.6(B:O)
N$87: IC16.16(B3) IC19.8(C:O)
N$88: IC16.15(B4) IC19.11(D:O)
N$89: IC16.14(B5) IC20.3(A:O)
N$90: IC16.13(B6) IC20.6(B:O)
N$91: IC16.12(B7) IC20.8(C:O)
N$92: IC16.11(B8) IC20.11(D:O)
N$93: IC21.18(B1) IC22.11(B8) R41.1
N$94: IC9.9(C:I0) IC9.10(C:I1) IC9.13(D:I1)
N$95: IC11.3(A:O) IC14.18(B1)
N$96: D42.1(K2) R43.2
N$97: D43.1(K2) R44.2
N$98: D44.1(K2) R45.2
N$99: D45.1(K2) R46.2
N$100: D46.1(K2) R47.2
N$101: D47.1(K2) R48.2
N$102: D48.1(K2) R49.2
N$103: D49.1(K2) R50.2
N$104: D50.1(K2) R51.2
N$105: D51.1(K2) R52.2
N$106: D52.1(K2) R53.2
N$107: D53.1(K2) R54.2
N$108: D54.1(K2) R55.2
N$109: D55.1(K2) R56.2
N$110: D56.1(K2) R57.2
N$119: D25.A IC4.1(A:I0) IC11.2(A:I1) IC17.2(A:I1) IC19.2(A:I1) SV_ALU_1.3
N$120: D26.A IC4.4(B:I0) IC11.5(B:I1) IC17.5(B:I1) IC19.5(B:I1) SV_ALU_1.5
N$122: D28.A IC4.12(D:I0) IC11.13(D:I1) IC17.13(D:I1) IC19.13(D:I1) SV_ALU_1.9
N$123: D29.A IC5.1(A:I0) IC13.2(A:I1) IC18.2(A:I1) IC20.2(A:I1) SV_ALU_1.11
N$124: D30.A IC5.4(B:I0) IC13.5(B:I1) IC18.5(B:I1) IC20.5(B:I1) SV_ALU_1.13
N$125: D31.A IC5.9(C:I0) IC13.10(C:I1) IC18.10(C:I1) IC20.10(C:I1) SV_ALU_1.15
N$129: D2.A IC12.3(A2) IC14.3(A2) IC15.3(A2) IC16.3(A2) IC21.3(A2) IC22.3(A2) IC23.3(A2) IC24.3(A2) IC25.3(A2) IC36.4(D2) IC37.3(A:I1)
N$130: D3.A IC12.4(A3) IC14.4(A3) IC15.4(A3) IC16.4(A3) IC21.4(A3) IC22.4(A3) IC23.4(A3) IC24.4(A3) IC25.4(A3) IC36.7(D3) IC37.5(B:I0)
N$131: D4.A IC12.5(A4) IC14.5(A4) IC15.5(A4) IC16.5(A4) IC21.5(A4) IC22.5(A4) IC23.5(A4) IC24.5(A4) IC25.5(A4) IC36.8(D4) IC37.6(B:I1)
N$132: D11.C R11.1
N$133: D10.C R10.1
N$134: D9.C R9.1
N$136: D3.C R3.1
N$137: D4.C R4.1
N$138: D5.C R5.1
N$139: D6.C R6.1
N$140: D7.C R7.1
N$141: D8.C R8.1
N$142: D17.C R17.1
N$143: D18.C R18.1
N$144: D19.C R19.1
N$145: D20.C R20.1
N$146: D21.C R21.1
N$147: D22.C R22.1
N$148: D23.C R23.1
N$149: D24.C R24.1
N$150: D25.C R25.1
N$151: D26.C R26.1
N$152: D27.C R27.1
N$153: D28.C R28.1
N$154: D29.C R29.1
N$155: D30.C R30.1
N$156: D16.A IC36.19(Q8) IC38.9(A8)
N$157: D15.A IC36.16(Q7) IC38.8(A7)
N$158: D14.A IC36.15(Q6) IC38.7(A6)
N$159: D13.A IC36.12(Q5) IC38.6(A5)
N$160: D12.A IC36.9(Q4) IC38.5(A4)
N$161: D11.A IC36.6(Q3) IC38.4(A3)
N$162: D10.A IC36.5(Q2) IC38.3(A2)
N$163: D9.A IC36.2(Q1) IC38.2(A1)
N$164: D31.C R31.1
N$165: D32.C R32.1
N$166: D5.A IC12.6(A5) IC14.6(A5) IC15.6(A5) IC16.6(A5) IC21.6(A5) IC22.6(A5) IC23.6(A5) IC24.6(A5) IC25.6(A5) IC36.13(D5) IC37.8(C:I0)
N$167: D7.A IC12.8(A7) IC14.8(A7) IC15.8(A7) IC16.8(A7) IC21.8(A7) IC22.8(A7) IC23.8(A7) IC24.8(A7) IC25.8(A7) IC36.17(D7) IC37.11(D:I0)
N$168: D8.A IC12.9(A8) IC14.9(A8) IC15.9(A8) IC16.9(A8) IC21.9(A8) IC22.9(A8) IC23.9(A8) IC24.9(A8) IC25.9(A8) IC36.18(D8) IC37.12(D:I1)
N$173: D6.A IC12.7(A6) IC14.7(A6) IC15.7(A6) IC16.7(A6) IC21.7(A6) IC22.7(A6) IC23.7(A6) IC24.7(A6) IC25.7(A6) IC36.14(D6) IC37.9(C:I1)
NEG: IC3.11 IC6.13(D:I1) IC8.11(E:I) IC9.4(B:I0) R52.1
NOT: IC3.10 IC6.12(D:I0) IC8.9(D:I) R51.1
OR: IC3.8 IC15.19(G) R49.1
ROL: IC3.16 IC24.19(G) R56.1
ROR: IC3.17 IC25.19(G) R57.1
SBC: IC3.4 IC6.5(B:I1) IC8.3(B:I) IC9.2(A:I1) R45.1
SHL: IC3.13 IC21.19(G) R53.1
SUB: IC3.3 IC6.4(B:I0) IC8.1(A:I) R44.1
VCC: C1.1 C2.1 C3.1 C4.1 C5.1 C6.1 C7.1 C8.1 C9.1 C10.1 C11.1 C12.1 C13.1 C14.1 C15.1 C16.1 C17.1 C18.1 C19.1 C20.1 C21.1 C22.1 C23.1 C24.1 C25.1 C26.1 C27.1 C28.1 C29.1 C30.1 C31.1 C32.1 C33.1 D41.2(A2) D42.2(A2) D43.2(A2) D44.2(A2) D45.2(A2) D46.2(A2) D47.2(A2) D48.2(A2) D49.2(A2) D50.2(A2) D51.2(A2) D52.2(A2) D53.2(A2) D54.2(A2) D55.2(A2) D56.2(A2) IC1.16(VCC) IC2.16(VCC) IC3.24(VCC) IC4.14(P:VCC) IC5.14(P:VCC) IC6.14(P:VCC) IC7.14(P:VCC) IC8.13(F:I) IC8.14(P:VCC) IC9.12(D:I0) IC9.14(P:VCC) IC10.14(P:VCC) IC11.14(P:VCC) IC12.20(VCC) IC13.14(P:VCC) IC14.20(VCC) IC15.20(VCC) IC16.20(VCC) IC17.14(P:VCC) IC18.14(P:VCC) IC19.14(P:VCC) IC20.14(P:VCC) IC21.20(VCC) IC22.20(VCC) IC23.20(VCC) IC24.20(VCC) IC25.20(VCC) IC36.20(VCC) IC37.14(P:VCC) IC38.1(DIR) IC38.20(VCC) IC39.14(P:VCC) R40.2 SV_ALU_1.1 SV_ALU_1.36 SV_ALU_2.1 SV_ALU_2.36 SV_ALU_SUP1.1 SV_ALU_SUP1.3 SV_ALU_SUP1.5 SV_ALU_SUP2.1 SV_ALU_SUP2.3 SV_ALU_SUP2.5 SV_ALU_SUP3.1 SV_ALU_SUP3.3 SV_ALU_SUP3.5 SV_ALU_SUP4.1 SV_ALU_SUP4.3 SV_ALU_SUP4.5 SV_ALU_SUP5.1 SV_ALU_SUP5.3 SV_ALU_SUP5.5 SV_ALU_SUP6.1 SV_ALU_SUP6.3 SV_ALU_SUP6.5
XOR: IC3.9 IC16.19(G) R50.1
Unconnected: IC8.12(F:O) IC9.8(C:O) IC9.11(D:O) IC21.11(B8) IC21.12(B7) IC21.13(B6) IC21.14(B5) IC21.15(B4) IC21.16(B3) IC21.17(B2) SV_ALU_1.4 SV_ALU_1.6 SV_ALU_1.8 SV_ALU_1.10 SV_ALU_1.12 SV_ALU_1.14 SV_ALU_1.16 SV_ALU_1.18 SV_ALU_1.20 SV_ALU_1.22 SV_ALU_1.24 SV_ALU_1.26 SV_ALU_2.4 SV_ALU_2.6 SV_ALU_2.8 SV_ALU_2.10 SV_ALU_2.12 SV_ALU_2.14 SV_ALU_2.16 SV_ALU_2.18 SV_ALU_2.19 SV_ALU_2.20 SV_ALU_2.21 SV_ALU_2.22 SV_ALU_2.34

## Notes on the sheet
- zero flag
- Right Hand
- sign flag
- enable carry

## Library data of the parts
C1-C33 = rcl:C-EU: CAPACITOR, European symbol; SPICEPREFIX: C
D1-D32 = Dargon's_lib:LTST-C193KRKT-5A: Red 631nm LED Indication - Discrete 2V 0603 (1608 Metric); MANUFACTURER: Lite-On; MAXIMUM_PACKAGE_HEIGHT: 0.45 mm; PARTREV: C; STANDARD: IPC 7351B
D33-D38 D40-D56 = Dargon's_lib:LTST-C193TBKT-5A: http://octopart.com/ltst-c190tbkt-lite-on-550003
IC1 IC2 = 74xx-eu:74*283: 4-bit binary FULL ADDER, fast carry
IC3 = 74xx-eu:74*154: 4-line to 16-line data SELECTOR/MULTIPLEXER
IC4 IC5 IC19 IC20 = 74xx-eu:74*86: Quad 2-input EXCLUSIVE-OR (XOR) gate
IC6 IC7 IC11 IC13 = 74xx-eu:74*08: Quad 2-input AND gate
IC8 = 74xx-eu:74*04: Hex INVERTER
IC9 = 74xx-eu:74*00: Quad 2-input NAND gate
IC10 IC17 IC18 IC39 = 74xx-eu:74*32: Quad 2-input OR gate
IC12 IC14-IC16 IC21-IC25 IC38 = 74xx-eu:74*245: Octal BUS TRANSCEIVER, 3-state
IC36 = 74xx-eu:74*273: Octal D type FLIP FLOP, clear
IC37 = 74xx-eu:74*02: Quad 2-input NOR gate
R1-R38 R40-R57 = rcl:R-EU_: RESISTOR, European symbol; SPICEPREFIX: R
SV_ALU_1 SV_ALU_2 = con-lstb:MA18-2: PIN HEADER; OC_FARNELL: unknown; OC_NEWARK: unknown
SV_ALU_SUP1-SV_ALU_SUP6 = con-lstb:MA03-2: PIN HEADER; OC_FARNELL: unknown; OC_NEWARK: unknown